# EAGLE design untitled01 (EAGLE 8.5.0)

## Sheet 1 of 3
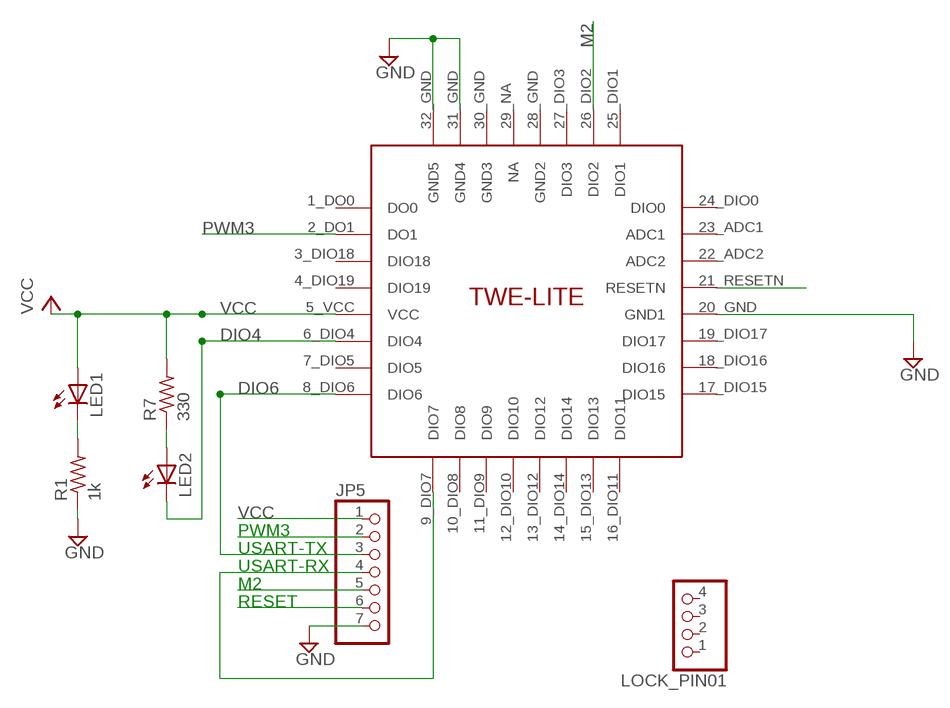
[diagram p0: schematic, sheet 1]

### Parts
JP5  PINHD-1X7  [1X07]
LED1  LEDCHIP-LED0603  [CHIP-LED0603]
LED2  LEDCHIP-LED0603  [CHIP-LED0603]
LOCK_PIN01  PINHD-1X4  [1X04]
R1  1k  R-US_R0805  [R0805]
R7  330  R-US_R0805  [R0805]
U$5  TWE-001L  [TWE-001L]

### Nets
DIO4: LED2.C U$5.6_DIO4(DIO4)
DIO6: JP5.3 U$5.8_DIO6(DIO6)
DIO7: JP5.4 U$5.9_DIO7(DIO7)
GND: JP5.7 R1.1 U$5.20_GND(GND1) U$5.31_GND(GND4) U$5.32_GND(GND5)
M2: JP5.5 U$5.26_DIO2(DIO2)
N$2: LED2.A R7.1
N$4: LED1.C R1.2
PWM3: JP5.2 U$5.2_DO1(DO1)
RESET: JP5.6 U$5.21_RESETN(RESETN)
VCC: JP5.1 LED1.A R7.2 U$5.5_VCC(VCC)
Unconnected: LOCK_PIN01.1 LOCK_PIN01.2 LOCK_PIN01.3 LOCK_PIN01.4 U$5.1_DO0(DO0) U$5.3_DIO18(DIO18) U$5.4_DIO19(DIO19) U$5.7_DIO5(DIO5) U$5.10_DIO8(DIO8) U$5.11_DIO9(DIO9) U$5.12_DIO10(DIO10) U$5.13_DIO12(DIO12) U$5.14_DIO14(DIO14) U$5.15_DIO13(DIO13) U$5.16_DIO11(DIO11) U$5.17_DIO15(DIO15) U$5.18_DIO16(DIO16) U$5.19_DIO17(DIO17) U$5.22_ADC2(ADC2) U$5.23_ADC1(ADC1) U$5.24_DIO0(DIO0) U$5.25_DIO1(DIO1) U$5.27_DIO3(DIO3) U$5.28_GND(GND2) U$5.29_NA(NA) U$5.30_GND(GND3)

### Notes on the sheet
- PWM3
- USART-TX
- USART-RX
- M2
- RESET

## Sheet 2 of 3
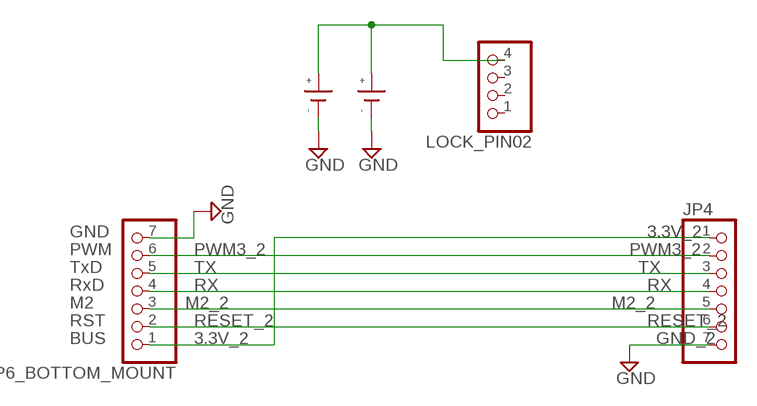
[diagram p1: schematic, sheet 2]

### Parts
JP4  PINHD-1X7  [1X07]
JP6_BOTTOM_MOUNT  PINHD-1X7  [1X07]
LOCK_PIN02  PINHD-1X4  [1X04]
U$2  CH004-2032LF  [CH004-2032LF]
U$3  CH004-2032LF  [CH004-2032LF]

### Nets
3.3V_2: JP4.1 JP6_BOTTOM_MOUNT.1
BATTERY_2: LOCK_PIN02.4 U$2.+ U$3.+
GND_2: JP4.7 JP6_BOTTOM_MOUNT.7 U$2.- U$3.- ; supply symbol labelled GND
M2_2: JP4.5 JP6_BOTTOM_MOUNT.3
PWM3_2: JP4.2 JP6_BOTTOM_MOUNT.6
RESET_2: JP4.6 JP6_BOTTOM_MOUNT.2
RX: JP4.4 JP6_BOTTOM_MOUNT.4
TX: JP4.3 JP6_BOTTOM_MOUNT.5
Unconnected: LOCK_PIN02.1 LOCK_PIN02.2 LOCK_PIN02.3

### Notes on the sheet
- GND
- PWM
- TxD
- RxD
- M2
- RST
- BUS

## Sheet 3 of 3
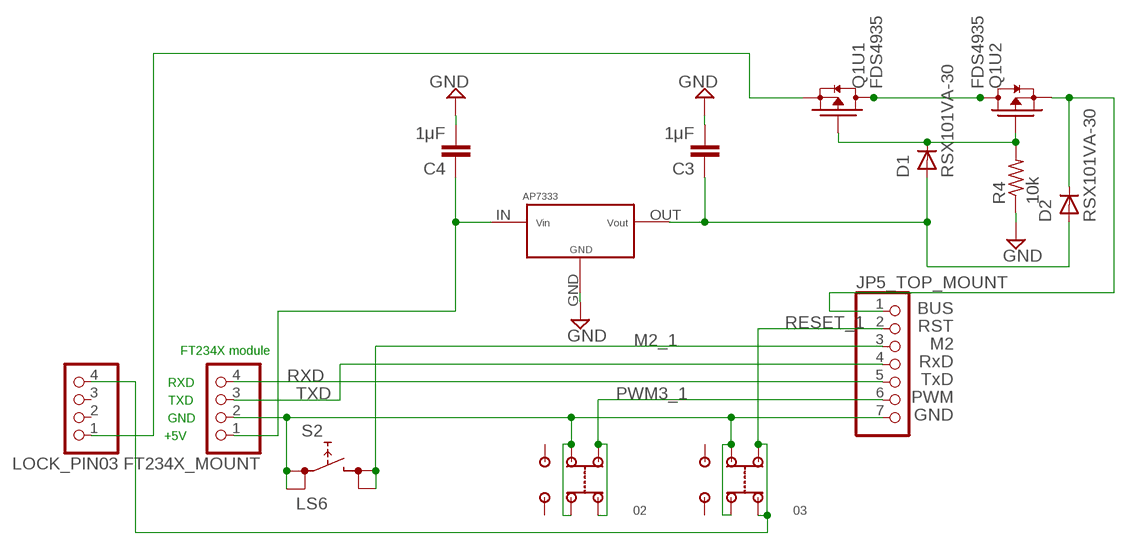
[diagram p2: schematic, sheet 3]

### Parts
02  SSSS213202  [SSSS213202]
03  SSSS213202  [SSSS213202]
C3  1μF  C-EUC1608  [C1608]
C4  1μF  C-EUC1608  [C1608]
D1  RSX101VA-30  [RSX101VA]
D2  RSX101VA-30  [RSX101VA]
FT234X_MOUNT  PINHD-1X4  [1X04]
JP5_TOP_MOUNT  PINHD-1X7  [1X07]
LOCK_PIN03  PINHD-1X4  [1X04]
Q1  FDS4935  [SOIC(8PIN)]
R4  10k  R-US_M0805  [M0805]
S2  LS6  [LS6]
U$4  AP7333_SOT-23  [AP7333_SOT-23]

### Nets
3.3V_1: C3.1 D1.ANODE(A) D2.ANODE(A) U$4.OUT
BATTERY_1: LOCK_PIN03.1 Q1.1(U1:S)
BUS_POWER: C4.1 FT234X_MOUNT.1 U$4.IN
GND_1: 02.2-1 02.2-2 03.2-1 03.2-2 C3.2 C4.2 FT234X_MOUNT.2 JP5_TOP_MOUNT.7 R4.1 S2.P$1 S2.P$2 U$4.GND ; supply symbol labelled GND
M2_1: JP5_TOP_MOUNT.3 S2.P$3 S2.P$4
N$6: D1.CATHODE(C) Q1.2(U1:G) Q1.4(U2:G) R4.2
N$7: Q1.5(U2:D2) Q1.6(U2:D1) Q1.7(U1:D2) Q1.8(U1:D1)
PWM3_1: 02.1-1 02.1-2 JP5_TOP_MOUNT.6
RESET_1: 03.1-1 03.1-2 JP5_TOP_MOUNT.2 LOCK_PIN03.4
RXD: FT234X_MOUNT.4 JP5_TOP_MOUNT.5
TXD: FT234X_MOUNT.3 JP5_TOP_MOUNT.4
VCC_1: D2.CATHODE(C) JP5_TOP_MOUNT.1 Q1.3(U2:S)
Unconnected: 02.3-1 02.3-2 03.3-1 03.3-2 LOCK_PIN03.2 LOCK_PIN03.3

### Notes on the sheet
- BUS
- RST
- M2
- FT234X module | RxD
- TxD
- RXD
- PWM
- TXD | GND
- GND
- +5V

## Library data of the parts
02 03 = SSSS213202:SSSS213202
C3 C4 = rcl:C-EU: CAPACITOR, European symbol; SPICEPREFIX: C
D1 D2 = diodes:RSX101VA-30
FT234X_MOUNT LOCK_PIN01-LOCK_PIN03 = pinhead:PINHD-1X4: PIN HEADER
JP4 JP5 JP5_TOP_MOUNT JP6_BOTTOM_MOUNT = pinhead:PINHD-1X7: PIN HEADER
LED1 LED2 = led:LED: LED OSRAM: - CHIPLED LG R971, LG N971, LY N971, LG Q971, LY Q971, LO R971, LY R971 LH N974, LH R974 LS Q976, LO Q976, LY Q976 LO Q996 - Hyper CHIPLED LW Q18S LB Q993, LB Q99A, LB R99A - SideLED LS A670, LO A670, LY A670, LG A670, LP A670 LB A673, LV A673, LT A673, LW A673 LH A674 LY A675 LS A676, LA A676, LO A676, LY A676, LW A676 LS A679, LY A679, LG A679 - Hyper Micro SIDELED® LS Y876, LA Y876, LO Y876, LY Y876 LT Y87S - SmartLED LW L88C, LW L88S LB L89C, LB L89S, LG L890 LS L89K, LO L89K, LY L89K LS L896, LA L896, LO L896, LY L896 - TOPLED LS T670, LO T670, LY T670, LG T670, LP T670 LSG T670, LSP T670, LSY T670, LOP T670, LYG T670 LG T671, LOG T671, LSG T671 LB T673, LV T673, LT T673, LW T673 LH T674 LS T676, LA T676, LO T676, LY T676, LB T676, LH T676, LSB T676, LW T676 LB T67C, LV T67C, LT T67C, LS T67K, LO T67K, LY T67K, LW E67C LS E67B, LA E67B, LO E67B, LY E67B, LB E67C, LV E67C, LT E67C LW T67C LS T679, LY T679, LG T679 LS T770, LO T770, LY T770, LG T770, LP T770 LB T773, LV T773, LT T773, LW T773 LH T774 LS E675, LA E675, LY E675, LS T675 LS T776, LA T776, LO T776, LY T776, LB T776 LHGB T686 LT T68C, LB T68C - Hyper Mini TOPLED® LB M676 - Mini TOPLED Santana® LG M470 LS M47K, LO M47K, LY M47K Source: http://www.osram.convergy.de LUXEON: - LUMILED® LXK2-PW12-R00, LXK2-PW12-S00, LXK2-PW14-U00, LXK2-PW14-V00 LXK2-PM12-R00, LXK2-PM12-S00, LXK2-PM14-U00 LXK2-PE12-Q00, LXK2-PE12-R00, LXK2-PE12-S00, LXK2-PE14-T00, LXK2-PE14-U00 LXK2-PB12-K00, LXK2-PB12-L00, LXK2-PB12-M00, LXK2-PB14-N00, LXK2-PB14-P00, LXK2-PB14-Q00 LXK2-PR12-L00, LXK2-PR12-M00, LXK2-PR14-Q00, LXK2-PR14-R00 LXK2-PD12-Q00, LXK2-PD12-R00, LXK2-PD12-S00 LXK2-PH12-R00, LXK2-PH12-S00 LXK2-PL12-P00, LXK2-PL12-Q00, LXK2-PL12-R00 Source: www.luxeon.com KINGBRIGHT: KA-3528ASYC Source: www.kingbright.com
Q1 = FET p-ch:FDS4935
R1 R7 = rcl:R-US_: RESISTOR, American symbol; SPICEPREFIX: R
R4 = resistor:R-US_: RESISTOR, American symbol
S2 = switch:LS6
U$2 U$3 = CH004-2032LF:CH004-2032LF
U$4 = Three-terminal regulator:AP7333_SOT-23
U$5 = twe-lite:TWE-001L

## Board
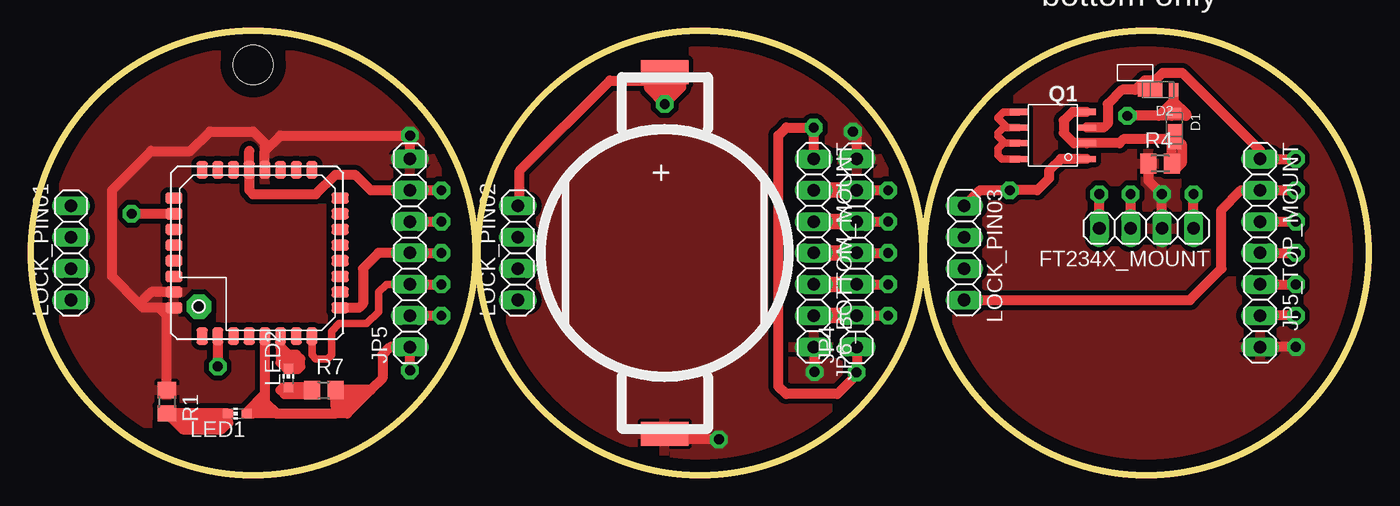
[diagram p3: board, top side]
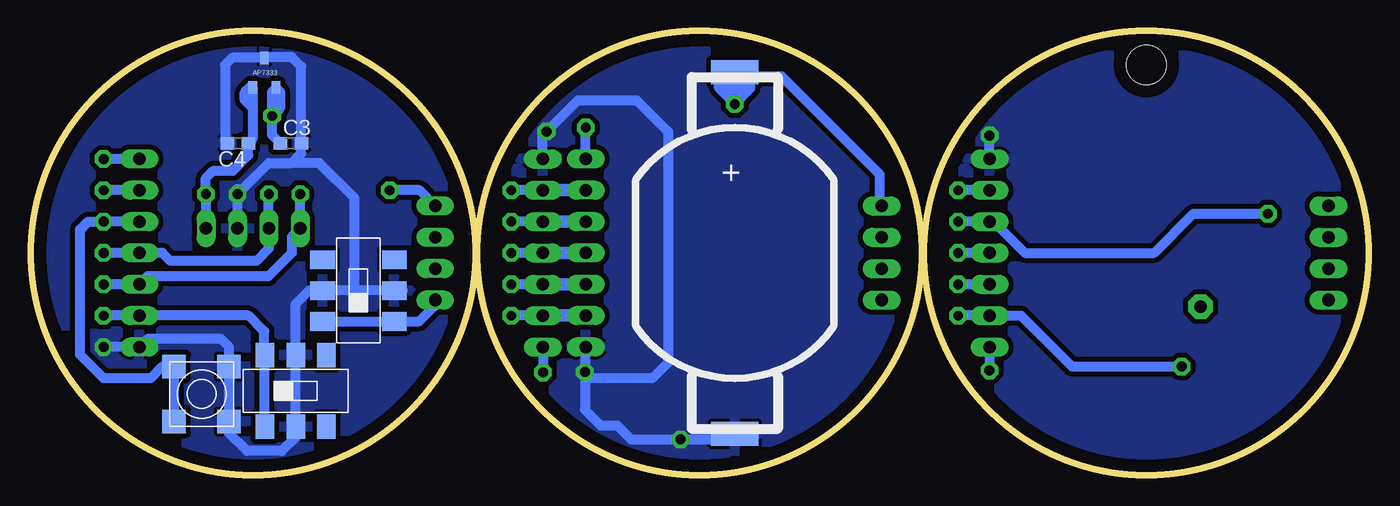
[diagram p4: board, bottom side, seen from below]

Size 108.34 x 36 mm. Coordinates in mm from the lower left corner, seen from the top.
Outline: circle at 18,18 radius 18
Outline: circle at 54.19,18 radius 18
Outline: circle at 90.34,18 radius 18
Copper layers (1*16): Top 0.035mm / dielectric 1.5mm / Bottom 0.035mm
Design rules "default *": minimum track width 12.5mil, minimum drill 24mil, track to track 8mil, track to pad 8mil, pad to pad 8mil, via to via 8mil, smd to smd 8mil, copper to edge 40mil, drill to drill 12.5mil, minimum pad ring 10mil, minimum via ring 8mil, stop-mask expansion 4mil, vias tented up to drill 0mil, thermal gap 10mil
Holes 3.2 mm at 18,33.24

### Footprints (pad centres in the part's own frame; a part is rotated, then mirrored left to right if it is on the bottom)
SSSS213202 = smd 1.5 x 2: 1-1 -2.5,2.9; 1-2 -2.5,-2.9; 2-1 0,2.9; 2-2 0,-2.9; 3-1 2.5,2.9; 3-2 2.5,-2.9
C1608 = smd 1.1 x 1: 1 -0.85,0; 2 0.85,0
RSX101VA = smd 0.8 x 1.1: ANODE -1.25,0 | smd 2 x 1.1: CATHODE 0.65,0
1X04 = drill 1.016 long: 1 -3.81,0; 2 -1.27,0; 3 1.27,0; 4 3.81,0
1X07 = drill 1.016 long: 1 -7.62,0; 2 -5.08,0; 3 -2.54,0; 4 0,0; 5 2.54,0; 6 5.08,0; 7 7.62,0
CHIP-LED0603 = smd 0.8 x 0.8: A 0,-0.75; C 0,0.75
SOIC(8PIN) = smd 1.5 x 0.5: 1 -2.74,1.905; 2 -2.74,0.635; 3 -2.74,-0.635; 4 -2.74,-1.905; 5 2.74,-1.905; 6 2.74,-0.635; 7 2.74,0.635; 8 2.74,1.905
R0805 = smd 1.3 x 1.5: 1 -0.95,0; 2 0.95,0
M0805 = smd 1.3 x 1.6: 1 -0.95,0; 2 0.95,0
LS6 = smd 1.905 x 1.905: P$1 -2.223,2.223; P$2 -2.223,-2.223; P$3 2.223,2.223; P$4 2.223,-2.223
CH004-2032LF = smd 1.93 x 3.81: + -14.65,0; - 14.65,0
AP7333_SOT-23 = smd 0.7 x 1: GND 0,1.2; IN -0.95,-1.2; OUT 0.95,-1.2
TWE-001L = smd 0.9 x 1.4: 1_DO0 -4.445,-6.735; 2_DO1 -3.175,-6.735; 3_DIO18 -1.905,-6.735; 4_DIO19 -0.635,-6.735; 5_VCC 0.635,-6.735; 6_DIO4 1.905,-6.735; 7_DIO5 3.175,-6.735; 8_DIO6 4.445,-6.735; 17_DIO15 4.445,6.735; 18_DIO16 3.175,6.735; 19_DIO17 1.905,6.735; 20_GND 0.635,6.735; 21_RESETN -0.635,6.735; 22_ADC2 -1.905,6.735; 23_ADC1 -3.175,6.735; 24_DIO0 -4.445,6.735 | smd 1.4 x 0.9: 9_DIO7 6.735,-4.445; 10_DIO8 6.735,-3.175; 11_DIO9 6.735,-1.905; 12_DIO10 6.735,-0.635; 13_DIO12 6.735,0.635; 14_DIO14 6.735,1.905; 15_DIO13 6.735,3.175; 16_DIO11 6.735,4.445; 25_DIO1 -6.735,4.445; 26_DIO2 -6.735,3.175; 27_DIO3 -6.735,1.905; 28_GND -6.735,0.635; 29_NA -6.735,-0.635; 30_GND -6.735,-1.905; 31_GND -6.735,-3.175; 32_GND -6.735,-4.445

### Placement (x,y rotation side)
02  86.9,6.82 0 bottom
03  81.82,14.95 90 bottom
C3  87.29,26.89 0 bottom
C4  91.58,26.89 180 bottom
D1  92.62,28.08 270 top
D2  91.3,31.22 180 top
FT234X_MOUNT  90.34,20 180 top
JP4  66.89,18 90 top
JP5  30.7,18 90 top
JP5_TOP_MOUNT  99.55,18 270 top
JP6_BOTTOM_MOUNT  63.4,18 270 top
LED1  16.73,4.98 90 top
LED2  20.86,7.84 0 top
LOCK_PIN01  3.25,18 90 top
LOCK_PIN02  39.45,18 90 top
LOCK_PIN03  75.6,18 270 top
Q1  82.77,27.52 180 top
R1  11.01,5.93 270 top
R4  91.47,25.24 0 top
R7  23.71,6.89 0 top
S2  94.52,6.57 180 bottom
U$2  51.34,18 270 bottom
U$3  51.34,18 270 top
U$4  89.44,32.61 0 bottom
U$5  18.32,18 0 top

### Tracks (layer width: path | path; a pad name or v marks a point on that pad's centre or on a via)
3.3V_1  (via drill 0.8 pad 1.42)
  Top 0.813: 92.39,29.11 D1.ANODE 92.55,29.41 92.55,30.31 | 92.39,29.11 91.34,29.11 | 91.34,29.11 v88.8,29.11 | D2.ANODE 92.55,30.31 | 91.34,29.11 92.55,30.31 | 92.55,30.31 93.56,29.29 93.56,29.11 92.39,29.11
  Bottom 0.813: 88.48,27.23 C3.1 88.8,27.55 v88.8,29.11 | v88.8,29.11 88.8,31.09 U$4.OUT 88.17,31.08 88.17,29.75 v88.8,29.11
3.3V_2  (via drill 0.8 pad 1.42)
  Top 0.813: JP6_BOTTOM_MOUNT.1 v63.4,28.16 61.18,28.16 60.55,27.52 60.55,7.21 61.18,6.57 65.31,6.57 66.89,8.16 JP4.1
  Bottom 0.813: JP6_BOTTOM_MOUNT.1 v63.4,28.16 | JP4.1 66.87,10.35 v66.87,8.32
BATTERY_1  (via drill 0.8 pad 1.42)
  Top 0.813: Q1.1 83.41,25.62 82.45,24.67 82.45,24.03 81.5,23.08 v79.28,23.08 76.87,23.08 LOCK_PIN03.1
  Bottom 0.813: LOCK_PIN03.1 76.87,23.08 v79.28,23.08
BATTERY_2  (via drill 0.8 pad 1.42)
  Top 0.813: v51.34,30.06 51.34,30.38 | 51.34,30.38 51.34,31.33 | 51.34,31.33 U$3.+ | LOCK_PIN02.4 39.59,21.95 39.59,24.67 46.89,31.97 50.07,31.97 | U$3.+ 50.66,31.97 50.07,31.97 | 51.34,31.33 50.7,31.33 50.07,31.97 | 51.34,31.33 51.97,31.33 52.61,31.97 | v51.34,30.06 50.07,31.33 50.07,31.97 | 51.34,30.38 52.67,31.72 | 52.67,31.72 52.67,32.94 51.62,32.94 U$3.+ | v51.34,30.06 52.67,31.4 52.67,31.72
  Bottom 0.813: v51.34,30.06 51.34,30.38 | 51.34,30.38 51.34,31.02 | 51.34,31.02 U$3.+ | 51.34,31.02 52.61,32.29 52.61,31.65 | 50.07,32.29 51.34,31.02 | v51.34,30.06 50.07,31.33 50.07,32.29 | 51.34,30.38 52.61,31.65 | LOCK_PIN02.4 39.59,21.95 39.59,24.35 47.53,32.29 50.07,32.29 | v51.34,30.06 52.61,31.33 52.61,31.65
BUS_POWER  (via drill 0.8 pad 1.42)
  Top 0.813: FT234X_MOUNT.1 94.16,22.75 v94.17,22.76
  Bottom 0.813: FT234X_MOUNT.1 94.16,22.75 v94.17,22.76 94.17,24.06 93.56,24.67 91.98,24.67 90.73,25.91 C4.1 90.39,27.23 90.39,29.75 | 90.39,29.75 U$4.IN 90.64,31.4 91.03,31.02 91.03,30.38 90.39,29.75
DIO4
  Top 0.813: LED2.C 20.86,9.34 | 20.86,9.74 20.86,9.43 20.86,9.34 | 20.86,9.74 20.22,10.38 | 20.22,10.38 U$5.6_DIO4 | 20.22,10.38 20.22,9.11 20.74,8.59 LED2.C | LED2.C 21.61,8.59 | 21.61,8.59 21.81,8.79 21.81,9.43 21.49,9.74 20.86,9.74 | 21.61,8.59 20.86,9.34
DIO6  (via drill 0.8 pad 1.42)
  Top 0.61: JP5.3 28.79,15.46 28.16,14.82 28.16,13.24 27.21,12.29 24.98,12.29 24.35,11.65 24.35,9.74 24.03,9.43 23.08,9.43 22.76,9.74 U$5.8_DIO6
  Top 0.813: JP5.3 v33.24,15.46
  Bottom 0.813: JP5.3 v33.24,15.46
DIO7  (via drill 0.8 pad 1.42)
  Top 0.813: U$5.9_DIO7 26.57,13.55 26.89,13.87 26.89,16.73 28.16,18 JP5.4 v33.24,18
  Bottom 0.813: JP5.4 v33.24,18
GND  (via drill 0.8 pad 1.42)
  Top 0.813: JP5.7 v30.7,27.52 20.22,27.52 18.95,26.25 | U$5.20_GND 18.95,26.25 | U$5.32_GND 10.38,13.55 | 10.38,13.55 9.11,13.55 8.79,13.87 | 8.79,13.87 6.57,16.09 6.57,23.08 9.74,26.25 12.92,26.25 14.51,27.84 18,27.84 18.95,26.89 18.95,26.25 | R1.1 11.01,12.92 10.38,13.55 | U$5.31_GND 9.74,14.82 8.79,13.87
  Bottom 0.813: JP5.7 v30.7,27.52
  pour Bottom (isolate 0.406): -0.1,37.05 36.1,37.05 36.1,-0.42 0.22,-0.1
  pour Top (isolate 0.406): -0.1,37.05 36.1,37.05 36.1,-0.42 0.22,-0.1
GND_1  (via drill 0.8 pad 1.42)
  Top 0.813: v102.45,10.38 JP5_TOP_MOUNT.7 | R4.1 90.52,23.85 v91.61,22.76 v91.62,22.76 FT234X_MOUNT.2
  Bottom 0.813: 78.2,14.95 03.2-2 82.14,14.95 | v102.45,10.38 JP5_TOP_MOUNT.7 98.92,11.01 92.93,11.01 92.3,10.38 S2.P$2 S2.P$1 92.3,3.39 90.85,1.95 88.03,1.95 86.9,3.08 02.2-2 02.2-1 86.9,13.87 85.82,14.95 03.2-1 82.14,14.95 | FT234X_MOUNT.2 v91.62,22.76 v91.61,22.76 | v91.61,22.76 91.61,23.2 | v91.61,22.76 89.07,25.3 87.22,25.3 | 87.22,25.3 86.44,26.07 C3.2 86.44,33.1 87.22,33.88 89.37,33.88 U$4.GND 92.05,33.8 92.61,33.24 92.61,27.07 C4.2 | 82.14,14.95 82.14,22.45 84.99,25.3 87.22,25.3
  pour Bottom (isolate 0.406): 72.29,36.73 108.49,36.73 108.49,-0.73 72.61,-0.42
  pour Top (isolate 0.406): 72.29,36.73 108.49,36.73 108.49,-0.73 72.61,-0.42
GND_2  (via drill 0.8 pad 1.42)
  Top 0.813: 63.47,10.32 v63.47,8.35 | v55.72,2.89 50.85,2.89 | 50.85,2.89 50.3,2.89 49.8,3.39 | 50.85,2.89 U$2.- | JP4.7 66.89,27.52 v66.58,27.84
  Bottom 0.813: v63.47,8.35 63.47,10.32 JP6_BOTTOM_MOUNT.7 | v63.47,8.35 63.47,5.3 62.2,4.03 60.86,4.03 59.72,2.89 v55.72,2.89 50.85,2.89 U$2.- | v63.47,8.35 62.96,7.84 58,7.84 56.73,9.11 56.73,27.84 59.28,30.38 64.04,30.38 v66.58,27.84 66.89,27.52 JP4.7
  pour Bottom (isolate 0.406): 36.1,37.05 72.29,37.05 72.29,-0.42 36.42,-0.1
  pour Top (isolate 0.406): 36.1,37.05 72.29,37.05 72.29,-0.42 36.42,-0.1
M2  (via drill 0.8 pad 1.42)
  Top 0.813: JP5.5 v33.24,20.54 | v8.16,21.18 U$5.26_DIO2
  Bottom 0.813: v33.24,20.54 JP5.5 30.38,20.54 27.84,18 17.36,18 14.19,21.18 v8.16,21.18
M2_1  (via drill 0.8 pad 1.42)
  Top 0.813: JP5_TOP_MOUNT.3 v102.45,20.54
  Bottom 0.813: S2.P$3 S2.P$4 97.69,8.79 98.64,7.84 102.45,7.84 104.36,9.74 104.36,19.9 103.73,20.54 v102.45,20.54 JP5_TOP_MOUNT.3
M2_2  (via drill 0.8 pad 1.42)
  Top 0.813: JP4.5 v69.44,20.54
  Top 1.27: JP6_BOTTOM_MOUNT.3 JP4.5
  Bottom 0.813: JP4.5 v69.44,20.54
  Bottom 1.016: JP6_BOTTOM_MOUNT.3 JP4.5
N$2
  Top 0.813: R7.1 22.56,7.09 LED2.A 20.43,7.09 20.22,6.89 20.54,6.57 22.13,6.57 22.45,6.89 R7.1
N$3  (via drill 1 pad 2)
  other vias: 13.61,13.66
N$4
  Top 0.813: 11.65,4.35 R1.2 LED1.C 15.98,4.23 15.46,3.71 12.29,3.71 11.65,4.34 11.65,4.35 | 11.65,4.35 15.78,4.35
N$6
  Top 0.813: Q1.4 84.36,29.43 83.66,28.73 83.66,27.71 84.48,26.89 Q1.2 88.17,26.89 88.48,27.21 92.39,27.21 D1.CATHODE | D1.CATHODE 92.42,27.24 R4.2 92.68,25.24 92.93,24.98 93.21,25.26 93.21,26.84 D1.CATHODE
N$7
  Top 0.61: Q1.8 78.64,25.62 78.33,25.94 78.33,26.45 78.77,26.89 78.9,26.89 | 78.9,26.89 Q1.7 | 78.9,26.89 78.33,27.46 78.33,27.71 78.77,28.16 79.09,28.16 | 79.09,28.16 Q1.6 | 79.09,28.16 78.33,28.92 78.33,28.98 78.77,29.43 Q1.5
PWM3  (via drill 0.8 pad 1.42)
  Top 0.813: U$5.2_DO1 v15.14,8.79 | JP5.2 v33.24,12.92
  Bottom 0.813: v15.14,8.79 24.03,8.79 28.16,12.92 JP5.2 v33.24,12.92
PWM3_1  (via drill 0.8 pad 1.42)
  Top 0.813: v102.45,12.92 JP5_TOP_MOUNT.6
  Bottom 0.813: 02.1-2 02.1-1 89.44,9.76 89.44,11.65 90.71,12.92 JP5_TOP_MOUNT.6 v102.45,12.92
PWM3_2  (via drill 0.8 pad 1.42)
  Top 0.813: JP4.2 v69.44,12.92
  Top 1.27: JP6_BOTTOM_MOUNT.6 JP4.2
  Bottom 0.813: JP4.2 v69.44,12.92
  Bottom 1.016: JP6_BOTTOM_MOUNT.6 JP4.2
RESET  (via drill 0.8 pad 1.42)
  Top 0.813: v33.24,23.08 JP5.6 27.52,23.08 26.25,24.35 24.67,24.35 23.08,22.76 18,22.76 17.68,23.08 U$5.21_RESETN 17.68,26.25
  Bottom 0.813: JP5.6 v33.24,23.08
RESET_1  (via drill 0.8 pad 1.42)
  Top 0.813: v102.45,23.08 JP5_TOP_MOUNT.2 98.01,23.08 96.42,21.49 96.42,16.73 93.88,14.19 LOCK_PIN03.4
  Bottom 0.813: 03.1-1 03.1-2 76.89,12.45 75.6,13.74 LOCK_PIN03.4 | JP5_TOP_MOUNT.2 v102.45,23.08
RESET_2  (via drill 0.8 pad 1.42)
  Top 0.813: JP4.6 v69.44,23.08
  Top 1.27: JP6_BOTTOM_MOUNT.2 JP4.6
  Bottom 0.813: JP4.6 v69.44,23.08
  Bottom 1.016: JP6_BOTTOM_MOUNT.2 JP4.6
RX  (via drill 0.8 pad 1.42)
  Top 0.813: JP4.4 v69.44,18
  Top 1.27: JP6_BOTTOM_MOUNT.4 JP4.4
  Bottom 0.813: JP4.4 v69.44,18
  Bottom 1.016: JP6_BOTTOM_MOUNT.4 JP4.4
RXD  (via drill 0.8 pad 1.42)
  Top 0.813: JP5_TOP_MOUNT.5 v102.45,15.46 | FT234X_MOUNT.4 v86.53,22.76
  Bottom 0.813: v102.45,15.46 JP5_TOP_MOUNT.5 98.92,16.09 89.12,16.09 87.22,18 87.22,19.32 FT234X_MOUNT.4 v86.53,22.76
TX  (via drill 0.8 pad 1.42)
  Top 0.813: JP4.3 v69.44,15.46
  Top 1.27: JP6_BOTTOM_MOUNT.5 JP4.3
  Bottom 0.813: JP4.3 v69.44,15.46
  Bottom 1.016: JP6_BOTTOM_MOUNT.5 JP4.3
TXD  (via drill 0.8 pad 1.42)
  Top 0.813: JP5_TOP_MOUNT.4 v102.45,18 | FT234X_MOUNT.3 v89.08,22.76 v89.07,22.76
  Bottom 0.813: v102.45,18 JP5_TOP_MOUNT.4 97.69,18 97.06,17.36 90.07,17.36 89.08,18.36 FT234X_MOUNT.3 v89.08,22.76 v89.07,22.76
VCC  (via drill 0.8 pad 1.42)
  Top 0.813: 27.52,6.89 28.48,7.84 28.48,9.74 29.11,10.38 JP5.1 v30.7,8.47 | 27.52,6.89 26.25,6.89 | 26.25,6.89 25.94,6.89 | 25.94,6.89 R7.2 24.67,5.62 | 18.95,5.93 19.9,4.98 | 19.9,4.98 24.67,4.98 | U$5.5_VCC 18.95,6.57 | 18.95,6.57 18.95,5.93 | 25.94,6.89 24.67,5.62 | 24.67,5.62 24.67,4.98 | 24.67,4.98 26.25,6.57 26.25,6.89 | 27.52,6.89 25.62,4.98 24.67,4.98 | 19.9,4.98 18,4.98 | 18.95,5.93 18,4.98 | 18,4.98 LED1.A 17.48,5.1 18.95,6.57
  Bottom 0.813: JP5.1 v30.7,8.47
VCC_1  (via drill 0.8 pad 1.42)
  Top 0.813: 89.44,31.22 D2.CATHODE 91.03,31.61 91.03,31.97 | 89.44,31.22 88.38,31.22 87.22,30.06 87.22,28.48 86.9,28.16 Q1.3 | 91.03,31.97 91.66,32.61 93.25,32.61 99.55,26.3 JP5_TOP_MOUNT.1 v102.45,25.62 | 91.03,31.97 90.18,31.97 89.44,31.22
  Bottom 0.813: JP5_TOP_MOUNT.1 v102.45,25.62

### Text on the board
tNames: bottom only